# Altium schematic sheet MT8365_LPDDR4X.SchDoc
size A3; SheetNumber: 4; SheetTotal: 35
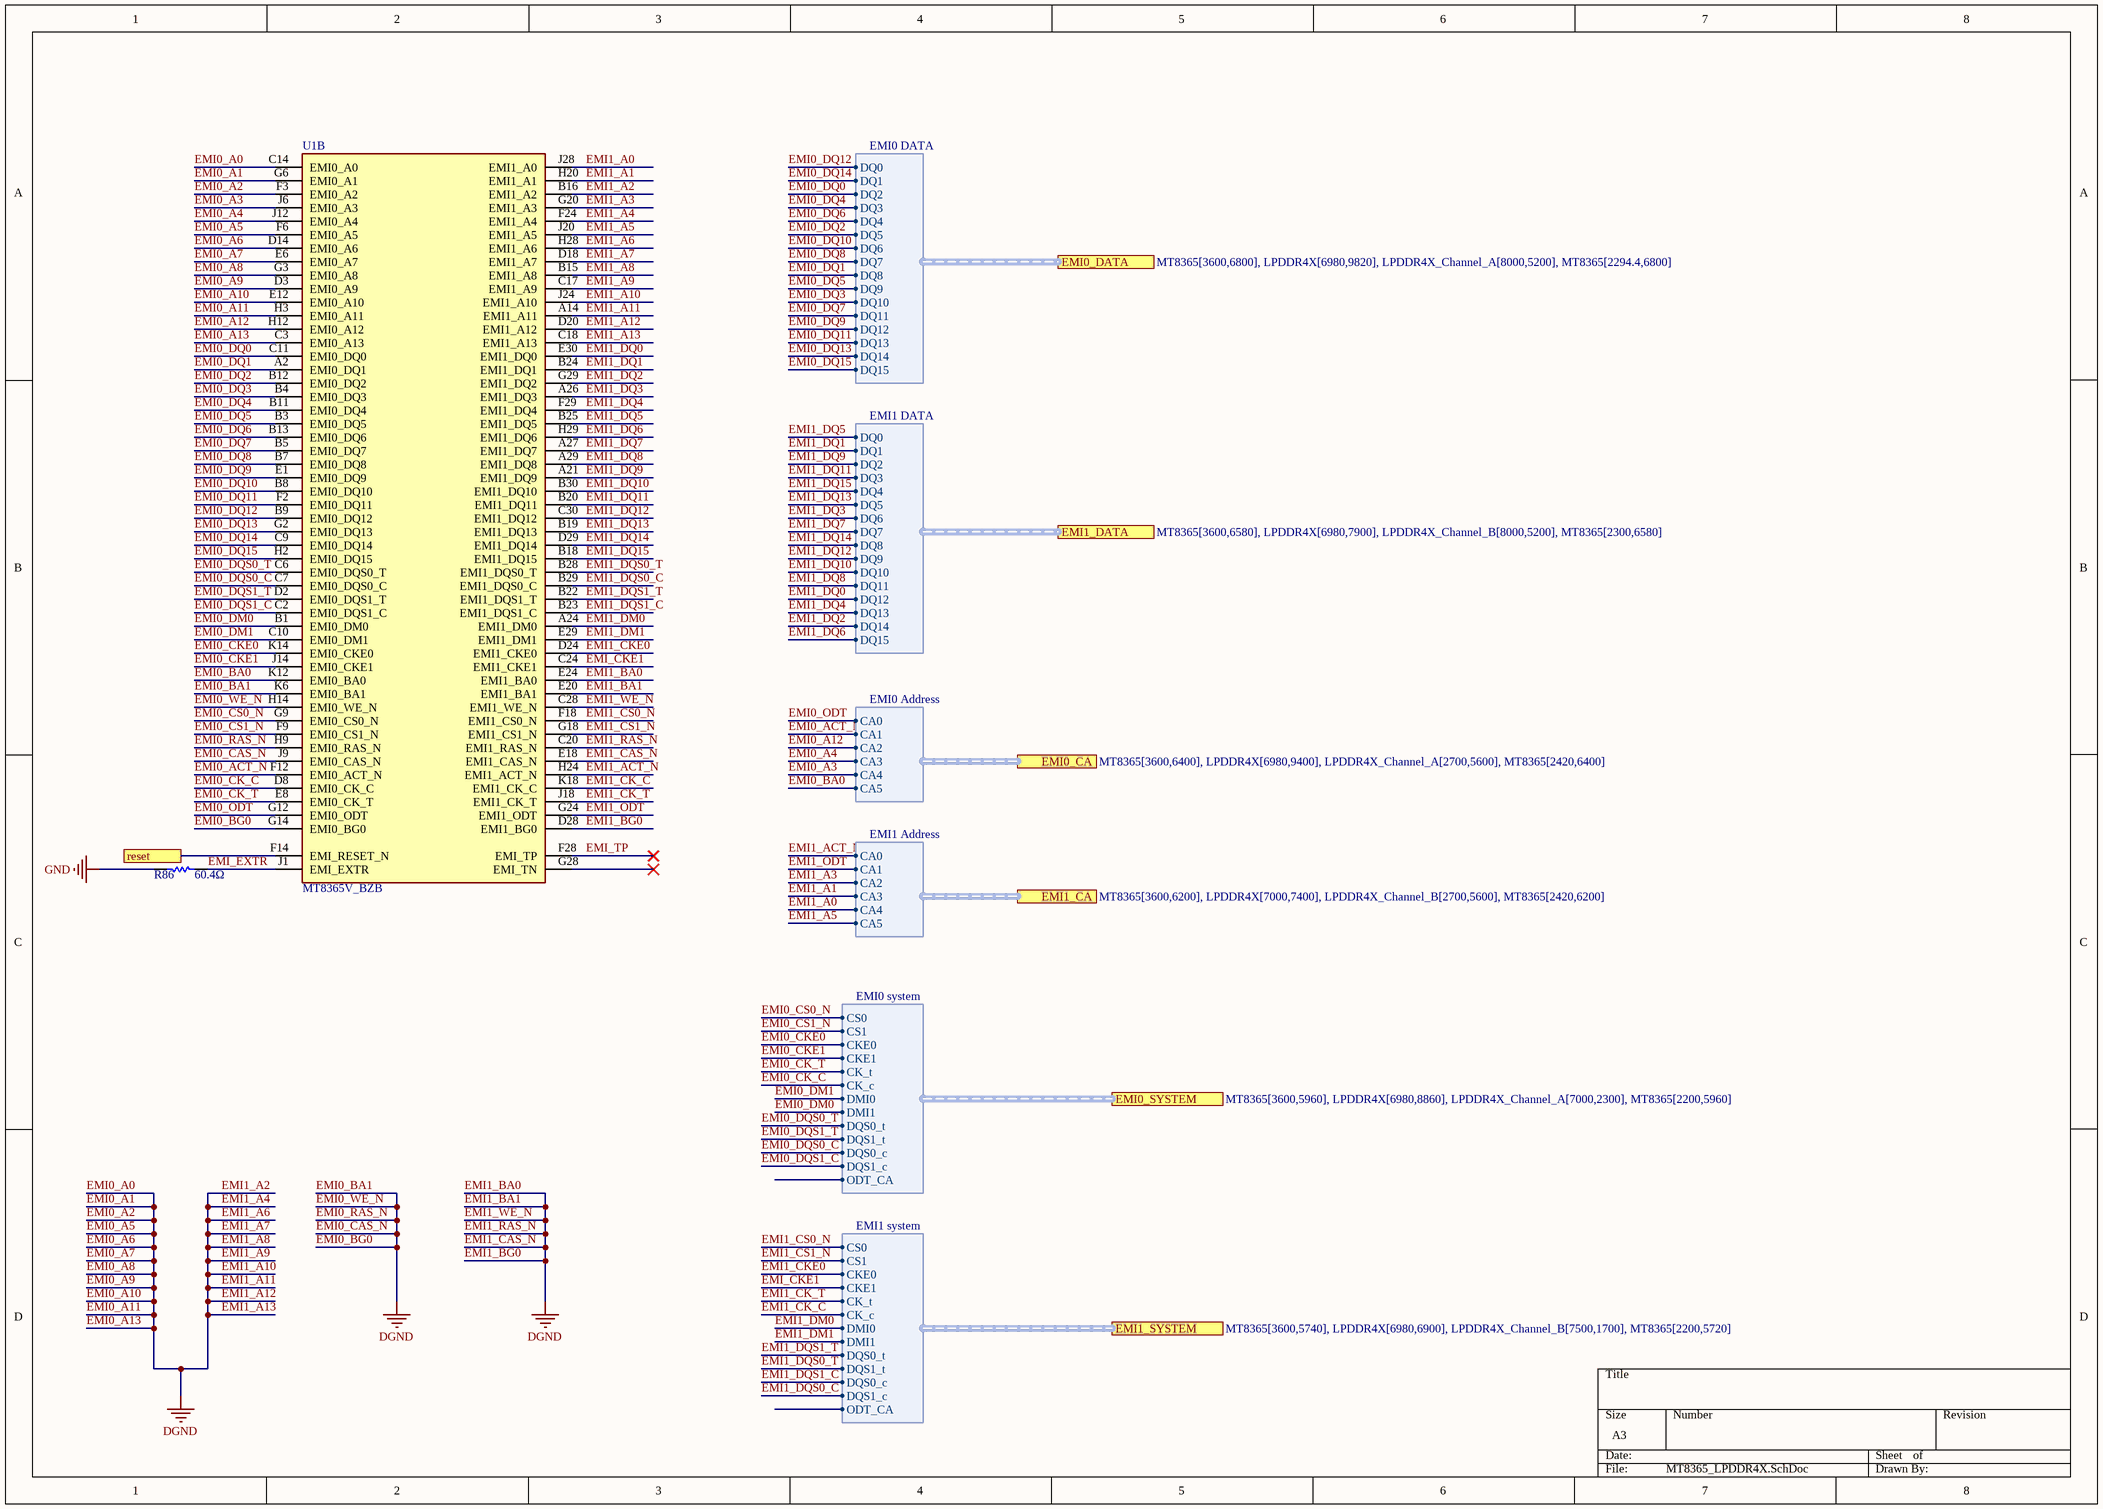
[diagram p0: MT8365_LPDDR4X.SchDoc]

## Parts
R86  value 60.4Ω  [R0603]  (hidden comment: R0603)
U1  MT8365V_BZB  [BGA633C40P30X29_1220X1180X90]  (part B of 11)

## Ports
EMI0_CA (harness EMI0 Address, see MT8365[3600,6400], LPDDR4X[6980,9400], LPDDR4X_Channel_A[2700,5600], MT8365[2420,6400]), EMI0_DATA (harness EMI0 DATA, see MT8365[3600,6800], LPDDR4X[6980,9820], LPDDR4X_Channel_A[8000,5200], MT8365[2294.4,6800]), EMI0_SYSTEM (harness EMI0 system, see MT8365[3600,5960], LPDDR4X[6980,8860], LPDDR4X_Channel_A[7000,2300], MT8365[2200,5960]), EMI1_CA (harness EMI1 Address, see MT8365[3600,6200], LPDDR4X[7000,7400], LPDDR4X_Channel_B[2700,5600], MT8365[2420,6200]), EMI1_DATA (harness EMI1 DATA, see MT8365[3600,6580], LPDDR4X[6980,7900], LPDDR4X_Channel_B[8000,5200], MT8365[2300,6580]), EMI1_SYSTEM (harness EMI1 system, see MT8365[3600,5740], LPDDR4X[6980,6900], LPDDR4X_Channel_B[7500,1700], MT8365[2200,5720]), reset (see MT8365[3600,5500], LPDDR4X[6980,2000], LPDDR4X_other[4080,4900])

## Harnesses
EMI0 DATA: DQ0, DQ1, DQ2, DQ3, DQ4, DQ5, DQ6, DQ7, DQ8, DQ9, DQ10, DQ11, DQ12, DQ13, DQ14, DQ15
EMI1 DATA: DQ0, DQ1, DQ2, DQ3, DQ4, DQ5, DQ6, DQ7, DQ8, DQ9, DQ10, DQ11, DQ12, DQ13, DQ14, DQ15
EMI0 Address: CA0, CA1, CA2, CA3, CA4, CA5
EMI1 Address: CA0, CA1, CA2, CA3, CA4, CA5
EMI0 system: CS0, CS1, CKE0, CKE1, CK_t, CK_c, DMI0, DMI1, DQS0_t, DQS1_t, DQS0_c, DQS1_c, ODT_CA
EMI1 system: CS0, CS1, CKE0, CKE1, CK_t, CK_c, DMI0, DMI1, DQS0_t, DQS1_t, DQS0_c, DQS1_c, ODT_CA

## Nets
EMI0_A0: U1.A14(EMI1_A11) U1.B15(EMI1_A8) U1.B16(EMI1_A2) U1.C3(EMI0_A13) U1.C14(EMI0_A0) U1.C17(EMI1_A9) U1.C18(EMI1_A13) U1.C20(EMI1_RAS_N) U1.C28(EMI1_WE_N) U1.D3(EMI0_A9) U1.D14(EMI0_A6) U1.D18(EMI1_A7) U1.D20(EMI1_A12) U1.D28(EMI1_BG0) U1.E6(EMI0_A7) U1.E12(EMI0_A10) U1.E18(EMI1_CAS_N) U1.E20(EMI1_BA1) U1.E24(EMI1_BA0) U1.F3(EMI0_A2) U1.F6(EMI0_A5) U1.F24(EMI1_A4) U1.G3(EMI0_A8) U1.G6(EMI0_A1) U1.G14(EMI0_BG0) U1.H3(EMI0_A11) U1.H9(EMI0_RAS_N) U1.H14(EMI0_WE_N) U1.H28(EMI1_A6) U1.J9(EMI0_CAS_N) U1.J24(EMI1_A10) U1.K6(EMI0_BA1)  [also labelled DGND, EMI0_A1, EMI0_A10, EMI0_A11, EMI0_A13, EMI0_A2, EMI0_A5, EMI0_A6, EMI0_A7, EMI0_A8, EMI0_A9, EMI0_BA1, EMI0_BG0, EMI0_CAS_N, EMI0_RAS_N, EMI0_WE_N, EMI1_A10, EMI1_A11, EMI1_A12, EMI1_A13, EMI1_A2, EMI1_A4, EMI1_A6, EMI1_A7, EMI1_A8, EMI1_A9, EMI1_BA0, EMI1_BA1, EMI1_BG0, EMI1_CAS_N, EMI1_RAS_N, EMI1_WE_N]
GND: R86.2
EMI0_A3: U1.J6(EMI0_A3) ; port EMI0_CA.CA4
EMI0_A4: U1.J12(EMI0_A4) ; port EMI0_CA.CA3
EMI0_A12: U1.H12(EMI0_A12) ; port EMI0_CA.CA2
EMI0_ACT_N: U1.F12(EMI0_ACT_N) ; port EMI0_CA.CA1
EMI0_BA0: U1.K12(EMI0_BA0) ; port EMI0_CA.CA5
EMI0_CK_C: U1.D8(EMI0_CK_C) ; port EMI0_SYSTEM.CK_c
EMI0_CK_T: U1.E8(EMI0_CK_T) ; port EMI0_SYSTEM.CK_t
EMI0_CKE0: U1.K14(EMI0_CKE0) ; port EMI0_SYSTEM.CKE0
EMI0_CKE1: U1.J14(EMI0_CKE1) ; port EMI0_SYSTEM.CKE1
EMI0_CS0_N: U1.G9(EMI0_CS0_N) ; port EMI0_SYSTEM.CS0
EMI0_CS1_N: U1.F9(EMI0_CS1_N) ; port EMI0_SYSTEM.CS1
EMI0_DM0: U1.B1(EMI0_DM0) ; port EMI0_SYSTEM.DMI1
EMI0_DM1: U1.C10(EMI0_DM1) ; port EMI0_SYSTEM.DMI0
EMI0_DQ0: U1.C11(EMI0_DQ0) ; port EMI0_DATA.DQ2
EMI0_DQ1: U1.A2(EMI0_DQ1) ; port EMI0_DATA.DQ8
EMI0_DQ2: U1.B12(EMI0_DQ2) ; port EMI0_DATA.DQ5
EMI0_DQ3: U1.B4(EMI0_DQ3) ; port EMI0_DATA.DQ10
EMI0_DQ4: U1.B11(EMI0_DQ4) ; port EMI0_DATA.DQ3
EMI0_DQ5: U1.B3(EMI0_DQ5) ; port EMI0_DATA.DQ9
EMI0_DQ6: U1.B13(EMI0_DQ6) ; port EMI0_DATA.DQ4
EMI0_DQ7: U1.B5(EMI0_DQ7) ; port EMI0_DATA.DQ11
EMI0_DQ8: U1.B7(EMI0_DQ8) ; port EMI0_DATA.DQ7
EMI0_DQ9: U1.E1(EMI0_DQ9) ; port EMI0_DATA.DQ12
EMI0_DQ10: U1.B8(EMI0_DQ10) ; port EMI0_DATA.DQ6
EMI0_DQ11: U1.F2(EMI0_DQ11) ; port EMI0_DATA.DQ13
EMI0_DQ12: U1.B9(EMI0_DQ12) ; port EMI0_DATA.DQ0
EMI0_DQ13: U1.G2(EMI0_DQ13) ; port EMI0_DATA.DQ14
EMI0_DQ14: U1.C9(EMI0_DQ14) ; port EMI0_DATA.DQ1
EMI0_DQ15: U1.H2(EMI0_DQ15) ; port EMI0_DATA.DQ15
EMI0_DQS0_C: U1.C7(EMI0_DQS0_C) ; port EMI0_SYSTEM.DQS0_c
EMI0_DQS0_T: U1.C6(EMI0_DQS0_T) ; port EMI0_SYSTEM.DQS0_t
EMI0_DQS1_C: U1.C2(EMI0_DQS1_C) ; port EMI0_SYSTEM.DQS1_c
EMI0_DQS1_T: U1.D2(EMI0_DQS1_T) ; port EMI0_SYSTEM.DQS1_t
EMI0_ODT: U1.G12(EMI0_ODT) ; port EMI0_CA.CA0
EMI1_A0: U1.J28(EMI1_A0) ; port EMI1_CA.CA4
EMI1_A1: U1.H20(EMI1_A1) ; port EMI1_CA.CA3
EMI1_A3: U1.G20(EMI1_A3) ; port EMI1_CA.CA2
EMI1_A5: U1.J20(EMI1_A5) ; port EMI1_CA.CA5
EMI1_ACT_N: U1.H24(EMI1_ACT_N) ; port EMI1_CA.CA0
EMI1_CK_C: U1.K18(EMI1_CK_C) ; port EMI1_SYSTEM.CK_c
EMI1_CK_T: U1.J18(EMI1_CK_T) ; port EMI1_SYSTEM.CK_t
EMI1_CKE0: U1.D24(EMI1_CKE0) ; port EMI1_SYSTEM.CKE0
EMI1_CS0_N: U1.F18(EMI1_CS0_N) ; port EMI1_SYSTEM.CS0
EMI1_CS1_N: U1.G18(EMI1_CS1_N) ; port EMI1_SYSTEM.CS1
EMI1_DM0: U1.A24(EMI1_DM0) ; port EMI1_SYSTEM.DMI0
EMI1_DM1: U1.E29(EMI1_DM1) ; port EMI1_SYSTEM.DMI1
EMI1_DQ0: U1.E30(EMI1_DQ0) ; port EMI1_DATA.DQ12
EMI1_DQ1: U1.B24(EMI1_DQ1) ; port EMI1_DATA.DQ1
EMI1_DQ2: U1.G29(EMI1_DQ2) ; port EMI1_DATA.DQ14
EMI1_DQ3: U1.A26(EMI1_DQ3) ; port EMI1_DATA.DQ6
EMI1_DQ4: U1.F29(EMI1_DQ4) ; port EMI1_DATA.DQ13
EMI1_DQ5: U1.B25(EMI1_DQ5) ; port EMI1_DATA.DQ0
EMI1_DQ6: U1.H29(EMI1_DQ6) ; port EMI1_DATA.DQ15
EMI1_DQ7: U1.A27(EMI1_DQ7) ; port EMI1_DATA.DQ7
EMI1_DQ8: U1.A29(EMI1_DQ8) ; port EMI1_DATA.DQ11
EMI1_DQ9: U1.A21(EMI1_DQ9) ; port EMI1_DATA.DQ2
EMI1_DQ10: U1.B30(EMI1_DQ10) ; port EMI1_DATA.DQ10
EMI1_DQ11: U1.B20(EMI1_DQ11) ; port EMI1_DATA.DQ3
EMI1_DQ12: U1.C30(EMI1_DQ12) ; port EMI1_DATA.DQ9
EMI1_DQ13: U1.B19(EMI1_DQ13) ; port EMI1_DATA.DQ5
EMI1_DQ14: U1.D29(EMI1_DQ14) ; port EMI1_DATA.DQ8
EMI1_DQ15: U1.B18(EMI1_DQ15) ; port EMI1_DATA.DQ4
EMI1_DQS0_C: U1.B29(EMI1_DQS0_C) ; port EMI1_SYSTEM.DQS1_c
EMI1_DQS0_T: U1.B28(EMI1_DQS0_T) ; port EMI1_SYSTEM.DQS1_t
EMI1_DQS1_C: U1.B23(EMI1_DQS1_C) ; port EMI1_SYSTEM.DQS0_c
EMI1_DQS1_T: U1.B22(EMI1_DQS1_T) ; port EMI1_SYSTEM.DQS0_t
EMI1_ODT: U1.G24(EMI1_ODT) ; port EMI1_CA.CA1
EMI_CKE1: U1.C24(EMI1_CKE1) ; port EMI1_SYSTEM.CKE1
EMI_EXTR: R86.1 U1.J1(EMI_EXTR)
EMI_TP: U1.F28(EMI_TP)
reset: U1.F14(EMI_RESET_N) ; port reset

Not connected (* = marked no-connect by the designer): U1 G28(EMI_TN)*

## Library data of the parts
U1 = MT8365V_BZB: Integrated Circuit; Manufacturer_Name: Mediatek; Manufacturer_Part_Number: MT8365V/BZB; Datasheet Link: https://www.mouser.co.uk/datasheet/2/1074/MT8365_AIoT_Application_Processor_Datasheet_v1_0_2-3106631.pdf; Height: 0.9mm; Mouser Part Number: 840-MT8365V/BZB; Mouser Price/Stock: https://www.mouser.co.uk/ProductDetail/MediaTek/MT8365V-BZB?qs=Jm2GQyTW%2FbjcedX9ugwNWQ%3D%3D